# Altium schematic sheet [5]-MCU_CONNECTORS.SchDoc
size A4
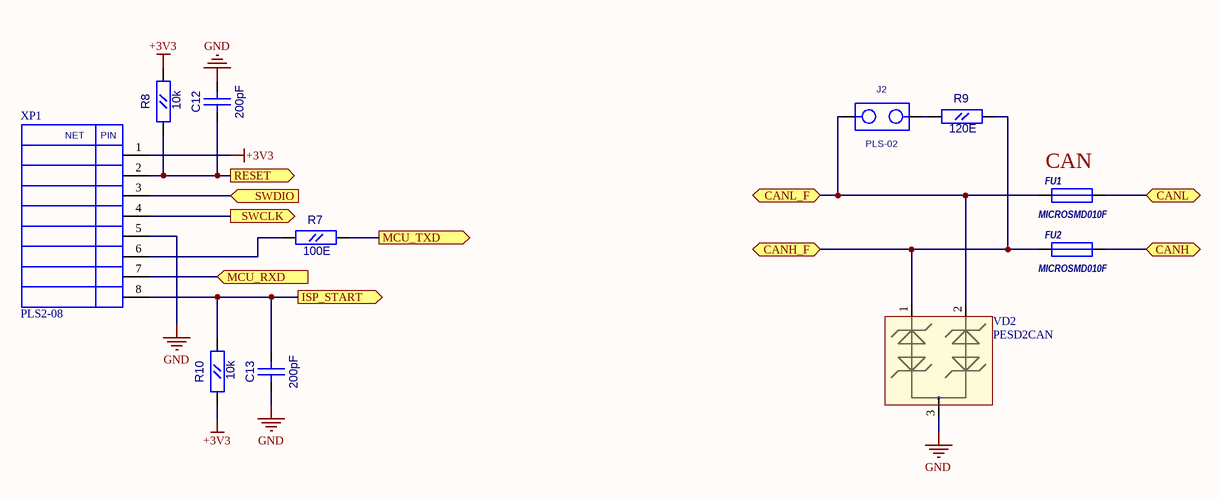
[diagram p0: [5]-MCU_CONNECTORS.SchDoc]

## Parts
C12  200pF  [CC0603]
C13  200pF  [CC0603]
FU1  MICROSMD010F  [RC1210]
FU2  MICROSMD010F  [RC1210]
J2  PLS-02  [PLS-02]
R7  100E  [RC0603]
R8  10k  [RC0603]
R9  120E  [RC0805]
R10  10k  [RC0603]
VD2  PESD2CAN  [SOT-23(123)]
XP1  PLS2-08  [PLS2-08]

## Ports
CANH (bidir), CANH_F (bidir), CANL (bidir), CANL_F (bidir), ISP_START (out), MCU_RXD (in), MCU_TXD (out), RESET (out), SWCLK (out), SWDIO (in)

## Nets
+3V3: R8.2(B) R10.1(A) XP1.1
GND: C12.2(B) C13.1(A) VD2.3 XP1.5
CANH: FU2.2 ; port CANH
CANH_F: FU2.1 R9.2(B) VD2.1 ; port CANH_F
CANL: FU1.2 ; port CANL
CANL_F: FU1.1 J2.1 VD2.2 ; port CANL_F
ISP_START: C13.2(B) R10.2(B) XP1.8 ; port ISP_START
MCU_RXD: XP1.7 ; port MCU_RXD
MCU_TXD: R7.2(B) ; port MCU_TXD
RESET: C12.1(A) R8.1(A) XP1.2 ; port RESET
SWCLK: XP1.4 ; port SWCLK
SWDIO: XP1.3 ; port SWDIO
NetJ2_2: J2.2 R9.1(A)
NetR7_1: R7.1(A) XP1.6

## Notes on the sheet
- (near FU1) CAN
- (in symbol PLS2-08) NET; PIN

## Library data of the parts
C12 C13 = CC0603: Value: 200pF
FU1 FU2 = MICROSMD: Value: *
R7 R8 R10 = RC0603
  R7: Value: 100E
  R8 R10: Value: 10k
R9 = RC0805: Value: 120E
VD2 = PESD2CAN: TVS for CAN
J2 = PLS-02: Value: *